# EAGLE schematic Protoboard MX3-11-8-ESP12 (EAGLE 7.7.0)

## Sheet 1 of 2
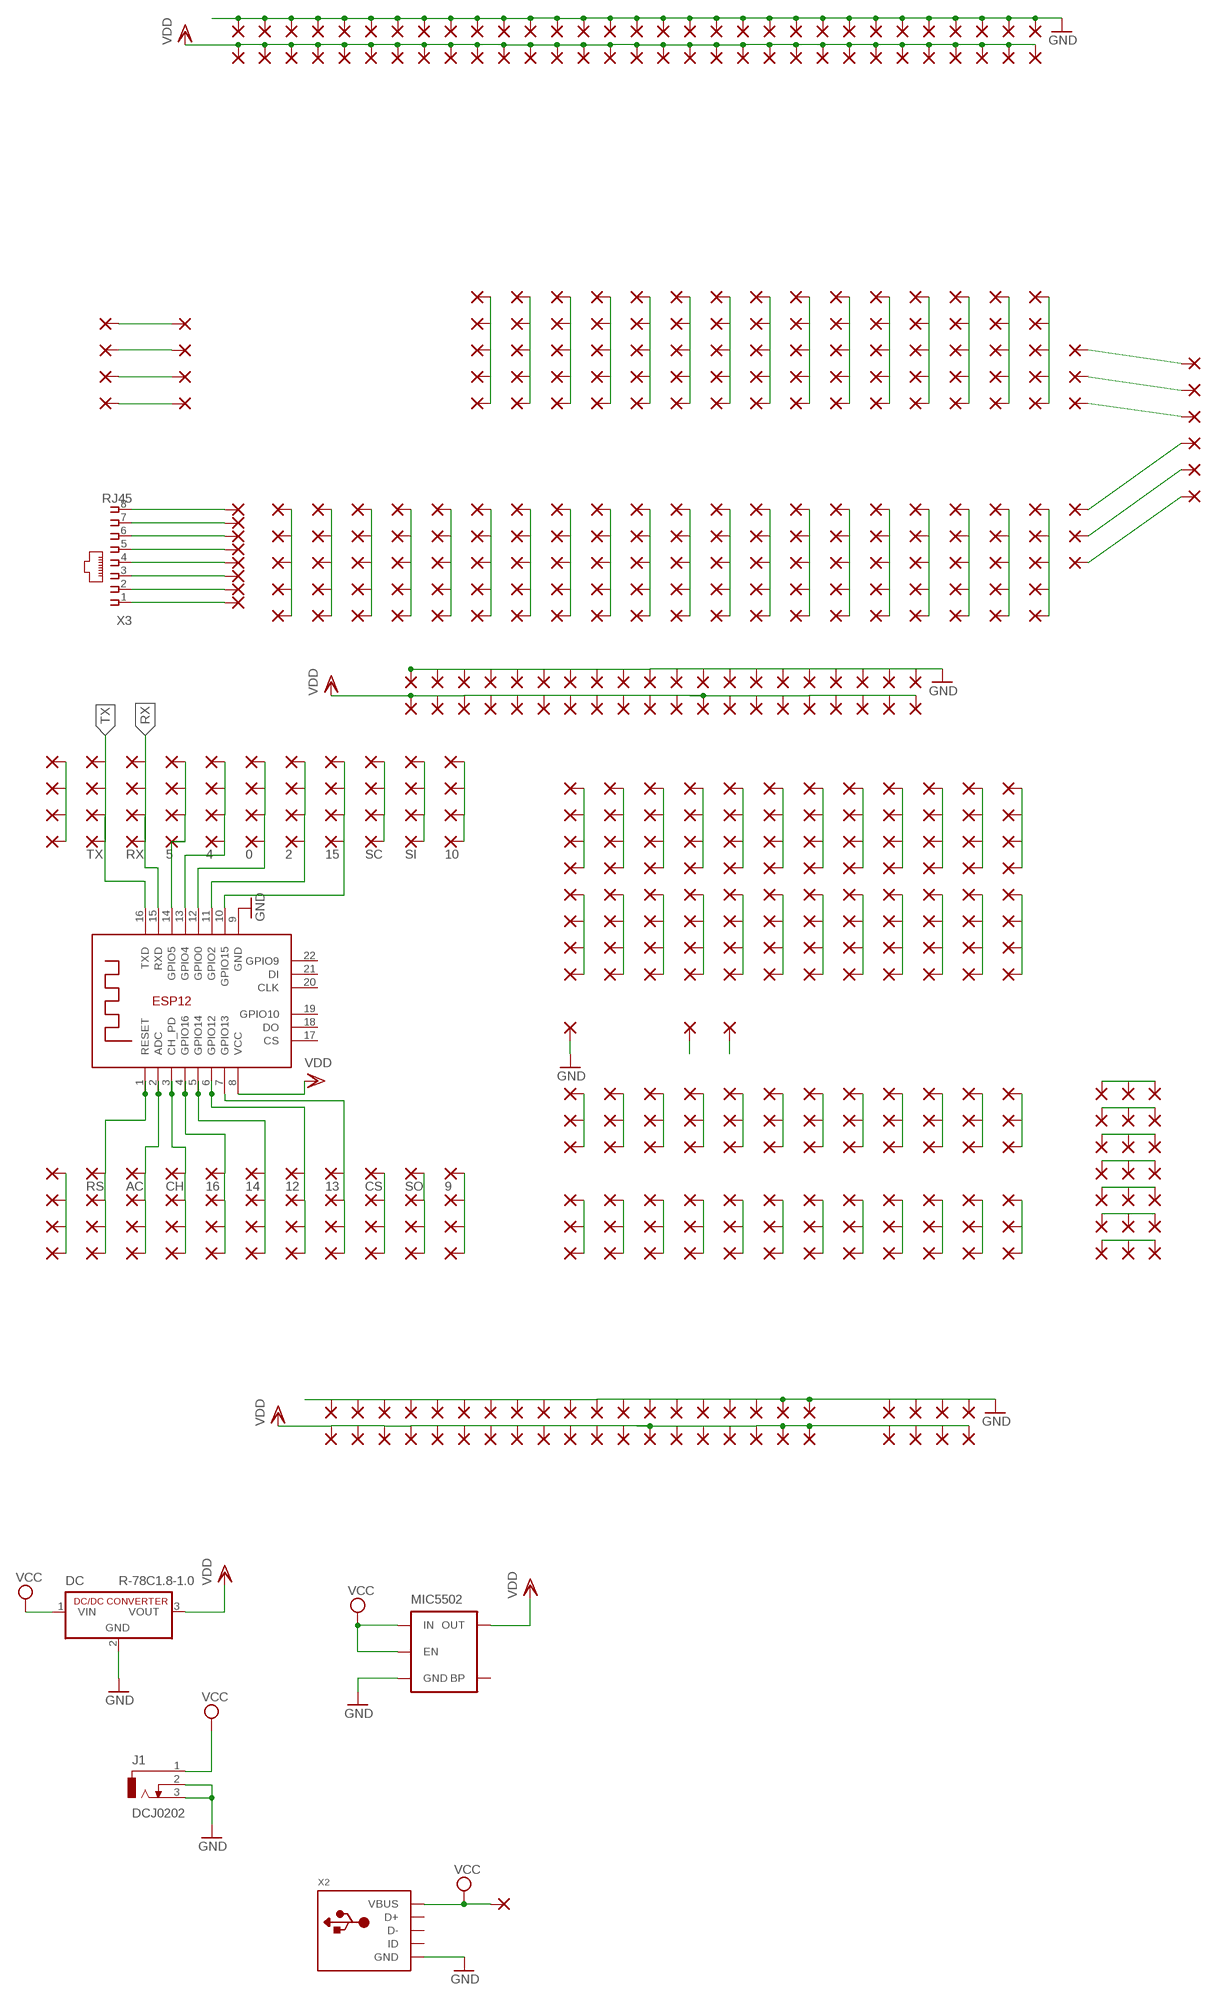
[diagram p0: schematic, sheet 1]

### Parts
1  1,6/0,8  [1,6/0,8]
2  1,6/0,8  [1,6/0,8]
4  1,6/0,8  [1,6/0,8]
5  1,6/0,8  [1,6/0,8]
5V  1,6/0,8  [1,6/0,8]
6  1,6/0,8  [1,6/0,8]
7  1,6/0,8  [1,6/0,8]
8  1,6/0,8  [1,6/0,8]
DC  R-78C1.8-1.0  [SIP3]
J1  DCJ0202  [DCJ0202]
MIC5502  MIC52053.3V  [SOT23-5]
PAD1  1,6/0,8  [1,6/0,8]
PAD2  1,6/0,8  [1,6/0,8]
PAD3  1,6/0,8  [1,6/0,8]
PAD4  1,6/0,8  [1,6/0,8]
PAD5  1,6/0,8  [1,6/0,8]
PAD6  1,6/0,8  [1,6/0,8]
PAD7  1,6/0,8  [1,6/0,8]
PAD8  1,6/0,8  [1,6/0,8]
PAD9  1,6/0,8  [1,6/0,8]
PAD10  1,6/0,8  [1,6/0,8]
PAD11  1,6/0,8  [1,6/0,8]
PAD12  1,6/0,8  [1,6/0,8]
PAD13  1,6/0,8  [1,6/0,8]
PAD14  1,6/0,8  [1,6/0,8]
PAD15  1,6/0,8  [1,6/0,8]
PAD16  1,6/0,8  [1,6/0,8]
PAD17  1,6/0,8  [1,6/0,8]
PAD18  1,6/0,8  [1,6/0,8]
PAD19  1,6/0,8  [1,6/0,8]
PAD20  1,6/0,8  [1,6/0,8]
PAD21  1,6/0,8  [1,6/0,8]
PAD22  1,6/0,8  [1,6/0,8]
PAD23  1,6/0,8  [1,6/0,8]
PAD24  1,6/0,8  [1,6/0,8]
PAD25  1,6/0,8  [1,6/0,8]
PAD26  1,6/0,8  [1,6/0,8]
PAD27  1,6/0,8  [1,6/0,8]
PAD28  1,6/0,8  [1,6/0,8]
PAD29  1,6/0,8  [1,6/0,8]
PAD30  1,6/0,8  [1,6/0,8]
PAD31  1,6/0,8  [1,6/0,8]
PAD32  1,6/0,8  [1,6/0,8]
PAD33  1,6/0,8  [1,6/0,8]
PAD34  1,6/0,8  [1,6/0,8]
PAD35  1,6/0,8  [1,6/0,8]
PAD36  1,6/0,8  [1,6/0,8]
PAD37  1,6/0,8  [1,6/0,8]
PAD38  1,6/0,8  [1,6/0,8]
PAD39  1,6/0,8  [1,6/0,8]
PAD40  1,6/0,8  [1,6/0,8]
PAD41  1,6/0,8  [1,6/0,8]
PAD42  1,6/0,8  [1,6/0,8]
PAD45  1,6/0,8  [1,6/0,8]
PAD46  1,6/0,8  [1,6/0,8]
PAD47  1,6/0,8  [1,6/0,8]
PAD48  1,6/0,8  [1,6/0,8]
PAD52  1,6/0,8  [1,6/0,8]
PAD53  1,6/0,8  [1,6/0,8]
PAD54  1,6/0,8  [1,6/0,8]
PAD55  1,6/0,8  [1,6/0,8]
PAD59  1,6/0,8  [1,6/0,8]
PAD60  1,6/0,8  [1,6/0,8]
PAD61  1,6/0,8  [1,6/0,8]
PAD62  1,6/0,8  [1,6/0,8]
PAD63  1,6/0,8  [1,6/0,8]
PAD64  1,6/0,8  [1,6/0,8]
PAD65  1,6/0,8  [1,6/0,8]
PAD66  1,6/0,8  [1,6/0,8]
PAD67  1,6/0,8  [1,6/0,8]
PAD68  1,6/0,8  [1,6/0,8]
PAD69  1,6/0,8  [1,6/0,8]
PAD70  1,6/0,8  [1,6/0,8]
PAD71  1,6/0,8  [1,6/0,8]
PAD72  1,6/0,8  [1,6/0,8]
PAD73  1,6/0,8  [1,6/0,8]
PAD74  1,6/0,8  [1,6/0,8]
PAD75  1,6/0,8  [1,6/0,8]
PAD76  1,6/0,8  [1,6/0,8]
PAD77  1,6/0,8  [1,6/0,8]
PAD78  1,6/0,8  [1,6/0,8]
PAD79  1,6/0,8  [1,6/0,8]
PAD80  1,6/0,8  [1,6/0,8]
PAD81  1,6/0,8  [1,6/0,8]
PAD82  1,6/0,8  [1,6/0,8]
PAD83  1,6/0,8  [1,6/0,8]
PAD84  1,6/0,8  [1,6/0,8]
PAD85  1,6/0,8  [1,6/0,8]
PAD86  1,6/0,8  [1,6/0,8]
PAD88  1,6/0,8  [1,6/0,8]
PAD89  1,6/0,8  [1,6/0,8]
PAD90  1,6/0,8  [1,6/0,8]
PAD91  1,6/0,8  [1,6/0,8]
PAD92  1,6/0,8  [1,6/0,8]
PAD93  1,6/0,8  [1,6/0,8]
PAD94  1,6/0,8  [1,6/0,8]
PAD97  1,6/0,8  [1,6/0,8]
PAD98  1,6/0,8  [1,6/0,8]
PAD99  1,6/0,8  [1,6/0,8]
PAD100  1,6/0,8  [1,6/0,8]
PAD101  1,6/0,8  [1,6/0,8]
PAD102  1,6/0,8  [1,6/0,8]
PAD103  1,6/0,8  [1,6/0,8]
PAD106  1,6/0,8  [1,6/0,8]
PAD107  1,6/0,8  [1,6/0,8]
PAD108  1,6/0,8  [1,6/0,8]
PAD109  1,6/0,8  [1,6/0,8]
PAD110  1,6/0,8  [1,6/0,8]
PAD111  1,6/0,8  [1,6/0,8]
PAD112  1,6/0,8  [1,6/0,8]
PAD115  1,6/0,8  [1,6/0,8]
PAD116  1,6/0,8  [1,6/0,8]
PAD117  1,6/0,8  [1,6/0,8]
PAD118  1,6/0,8  [1,6/0,8]
PAD119  1,6/0,8  [1,6/0,8]
PAD120  1,6/0,8  [1,6/0,8]
PAD121  1,6/0,8  [1,6/0,8]
PAD122  1,6/0,8  [1,6/0,8]
PAD123  1,6/0,8  [1,6/0,8]
PAD124  1,6/0,8  [1,6/0,8]
PAD125  1,6/0,8  [1,6/0,8]
PAD126  1,6/0,8  [1,6/0,8]
PAD128  1,6/0,8  [1,6/0,8]
PAD129  1,6/0,8  [1,6/0,8]
PAD130  1,6/0,8  [1,6/0,8]
PAD131  1,6/0,8  [1,6/0,8]
PAD132  1,6/0,8  [1,6/0,8]
PAD133  1,6/0,8  [1,6/0,8]
PAD134  1,6/0,8  [1,6/0,8]
PAD135  1,6/0,8  [1,6/0,8]
PAD137  1,6/0,8  [1,6/0,8]
PAD138  1,6/0,8  [1,6/0,8]
PAD139  1,6/0,8  [1,6/0,8]
PAD140  1,6/0,8  [1,6/0,8]
PAD141  1,6/0,8  [1,6/0,8]
PAD142  1,6/0,8  [1,6/0,8]
PAD143  1,6/0,8  [1,6/0,8]
PAD144  1,6/0,8  [1,6/0,8]
PAD146  1,6/0,8  [1,6/0,8]
PAD147  1,6/0,8  [1,6/0,8]
PAD148  1,6/0,8  [1,6/0,8]
PAD149  1,6/0,8  [1,6/0,8]
PAD150  1,6/0,8  [1,6/0,8]
PAD151  1,6/0,8  [1,6/0,8]
PAD152  1,6/0,8  [1,6/0,8]
PAD153  1,6/0,8  [1,6/0,8]
PAD155  1,6/0,8  [1,6/0,8]
PAD156  1,6/0,8  [1,6/0,8]
PAD157  1,6/0,8  [1,6/0,8]
PAD158  1,6/0,8  [1,6/0,8]
PAD159  1,6/0,8  [1,6/0,8]
PAD160  1,6/0,8  [1,6/0,8]
PAD161  1,6/0,8  [1,6/0,8]
PAD162  1,6/0,8  [1,6/0,8]
PAD164  1,6/0,8  [1,6/0,8]
PAD165  1,6/0,8  [1,6/0,8]
PAD166  1,6/0,8  [1,6/0,8]
PAD167  1,6/0,8  [1,6/0,8]
PAD168  1,6/0,8  [1,6/0,8]
PAD169  1,6/0,8  [1,6/0,8]
PAD170  1,6/0,8  [1,6/0,8]
PAD171  1,6/0,8  [1,6/0,8]
PAD173  1,6/0,8  [1,6/0,8]
PAD174  1,6/0,8  [1,6/0,8]
PAD175  1,6/0,8  [1,6/0,8]
PAD176  1,6/0,8  [1,6/0,8]
PAD177  1,6/0,8  [1,6/0,8]
PAD178  1,6/0,8  [1,6/0,8]
PAD179  1,6/0,8  [1,6/0,8]
PAD180  1,6/0,8  [1,6/0,8]
PAD182  1,6/0,8  [1,6/0,8]
PAD183  1,6/0,8  [1,6/0,8]
PAD184  1,6/0,8  [1,6/0,8]
PAD185  1,6/0,8  [1,6/0,8]
PAD186  1,6/0,8  [1,6/0,8]
PAD194  1,6/0,8  [1,6/0,8]
PAD195  1,6/0,8  [1,6/0,8]
PAD196  1,6/0,8  [1,6/0,8]
PAD197  1,6/0,8  [1,6/0,8]
PAD198  1,6/0,8  [1,6/0,8]
PAD199  1,6/0,8  [1,6/0,8]
PAD200  1,6/0,8  [1,6/0,8]
PAD201  1,6/0,8  [1,6/0,8]
PAD202  1,6/0,8  [1,6/0,8]
PAD203  1,6/0,8  [1,6/0,8]
PAD204  1,6/0,8  [1,6/0,8]
PAD205  1,6/0,8  [1,6/0,8]
PAD206  1,6/0,8  [1,6/0,8]
PAD207  1,6/0,8  [1,6/0,8]
PAD208  1,6/0,8  [1,6/0,8]
PAD209  1,6/0,8  [1,6/0,8]
PAD210  1,6/0,8  [1,6/0,8]
PAD211  1,6/0,8  [1,6/0,8]
PAD212  1,6/0,8  [1,6/0,8]
PAD213  1,6/0,8  [1,6/0,8]
PAD214  1,6/0,8  [1,6/0,8]
PAD215  1,6/0,8  [1,6/0,8]
PAD216  1,6/0,8  [1,6/0,8]
PAD217  1,6/0,8  [1,6/0,8]
PAD218  1,6/0,8  [1,6/0,8]
PAD219  1,6/0,8  [1,6/0,8]
PAD220  1,6/0,8  [1,6/0,8]
PAD221  1,6/0,8  [1,6/0,8]
PAD222  1,6/0,8  [1,6/0,8]
PAD223  1,6/0,8  [1,6/0,8]
PAD224  1,6/0,8  [1,6/0,8]
PAD225  1,6/0,8  [1,6/0,8]
PAD226  1,6/0,8  [1,6/0,8]
PAD227  1,6/0,8  [1,6/0,8]
PAD228  1,6/0,8  [1,6/0,8]
PAD229  1,6/0,8  [1,6/0,8]
PAD230  1,6/0,8  [1,6/0,8]
PAD231  1,6/0,8  [1,6/0,8]
PAD232  1,6/0,8  [1,6/0,8]
PAD233  1,6/0,8  [1,6/0,8]
PAD234  1,6/0,8  [1,6/0,8]
PAD235  1,6/0,8  [1,6/0,8]
PAD236  1,6/0,8  [1,6/0,8]
PAD237  1,6/0,8  [1,6/0,8]
PAD238  1,6/0,8  [1,6/0,8]
PAD239  1,6/0,8  [1,6/0,8]
PAD240  1,6/0,8  [1,6/0,8]
PAD241  3,17/1,3  [3,17/1,3]
PAD242  3,17/1,3  [3,17/1,3]
PAD243  3,17/1,3  [3,17/1,3]
PAD244  3,17/1,3  [3,17/1,3]
PAD249  1,6/0,8  [1,6/0,8]
PAD250  1,6/0,8  [1,6/0,8]
PAD251  1,6/0,8  [1,6/0,8]
PAD252  1,6/0,8  [1,6/0,8]
PAD253  1,6/0,8  [1,6/0,8]
PAD254  1,6/0,8  [1,6/0,8]
PAD255  1,6/0,8  [1,6/0,8]
PAD256  1,6/0,8  [1,6/0,8]
PAD257  1,6/0,8  [1,6/0,8]
PAD258  1,6/0,8  [1,6/0,8]
PAD259  TX  1,6/0,8  [1,6/0,8]
PAD267  1,6/0,8  [1,6/0,8]
PAD268  1,6/0,8  [1,6/0,8]
PAD276  1,6/0,8  [1,6/0,8]
PAD277  1,6/0,8  [1,6/0,8]
PAD285  1,6/0,8  [1,6/0,8]
PAD286  1,6/0,8  [1,6/0,8]
PAD294  1,6/0,8  [1,6/0,8]
PAD295  1,6/0,8  [1,6/0,8]
PAD303  1,6/0,8  [1,6/0,8]
PAD304  1,6/0,8  [1,6/0,8]
PAD312  1,6/0,8  [1,6/0,8]
PAD313  1,6/0,8  [1,6/0,8]
PAD321  1,6/0,8  [1,6/0,8]
PAD322  1,6/0,8  [1,6/0,8]
PAD323  1,6/0,8  [1,6/0,8]
PAD324  1,6/0,8  [1,6/0,8]
PAD325  1,6/0,8  [1,6/0,8]
PAD326  1,6/0,8  [1,6/0,8]
PAD327  1,6/0,8  [1,6/0,8]
PAD328  1,6/0,8  [1,6/0,8]
PAD329  1,6/0,8  [1,6/0,8]
PAD330  1,6/0,8  [1,6/0,8]
PAD331  1,6/0,8  [1,6/0,8]
PAD339  1,6/0,8  [1,6/0,8]
PAD340  1,6/0,8  [1,6/0,8]
PAD348  1,6/0,8  [1,6/0,8]
PAD349  1,6/0,8  [1,6/0,8]
PAD357  1,6/0,8  [1,6/0,8]
PAD358  1,6/0,8  [1,6/0,8]
PAD366  1,6/0,8  [1,6/0,8]
PAD367  1,6/0,8  [1,6/0,8]
PAD375  1,6/0,8  [1,6/0,8]
PAD376  1,6/0,8  [1,6/0,8]
PAD384  1,6/0,8  [1,6/0,8]
PAD390  1,6/0,8  [1,6/0,8]
PAD395  1,6/0,8  [1,6/0,8]
PAD396  1,6/0,8  [1,6/0,8]
PAD397  RX  1,6/0,8  [1,6/0,8]
PAD398  1,6/0,8  [1,6/0,8]
PAD399  1,6/0,8  [1,6/0,8]
PAD400  1,6/0,8  [1,6/0,8]
PAD401  5  1,6/0,8  [1,6/0,8]
PAD402  1,6/0,8  [1,6/0,8]
PAD403  1,6/0,8  [1,6/0,8]
PAD404  1,6/0,8  [1,6/0,8]
PAD405  4  1,6/0,8  [1,6/0,8]
PAD406  1,6/0,8  [1,6/0,8]
PAD407  1,6/0,8  [1,6/0,8]
PAD408  1,6/0,8  [1,6/0,8]
PAD409  0  1,6/0,8  [1,6/0,8]
PAD410  1,6/0,8  [1,6/0,8]
PAD411  1,6/0,8  [1,6/0,8]
PAD412  1,6/0,8  [1,6/0,8]
PAD413  2  1,6/0,8  [1,6/0,8]
PAD414  1,6/0,8  [1,6/0,8]
PAD415  1,6/0,8  [1,6/0,8]
PAD416  1,6/0,8  [1,6/0,8]
PAD417  1,6/0,8  [1,6/0,8]
PAD418  1,6/0,8  [1,6/0,8]
PAD419  1,6/0,8  [1,6/0,8]
PAD420  1,6/0,8  [1,6/0,8]
PAD421  1,6/0,8  [1,6/0,8]
PAD422  1,6/0,8  [1,6/0,8]
PAD423  1,6/0,8  [1,6/0,8]
PAD424  1,6/0,8  [1,6/0,8]
PAD425  1,6/0,8  [1,6/0,8]
PAD426  1,6/0,8  [1,6/0,8]
PAD427  1,6/0,8  [1,6/0,8]
PAD428  1,6/0,8  [1,6/0,8]
PAD429  1,6/0,8  [1,6/0,8]
PAD430  1,6/0,8  [1,6/0,8]
PAD431  1,6/0,8  [1,6/0,8]
PAD432  1,6/0,8  [1,6/0,8]
PAD433  1,6/0,8  [1,6/0,8]
PAD434  1,6/0,8  [1,6/0,8]
PAD435  1,6/0,8  [1,6/0,8]
PAD436  1,6/0,8  [1,6/0,8]
PAD437  1,6/0,8  [1,6/0,8]
PAD438  1,6/0,8  [1,6/0,8]
PAD439  1,6/0,8  [1,6/0,8]
PAD440  1,6/0,8  [1,6/0,8]
PAD441  1,6/0,8  [1,6/0,8]
PAD442  1,6/0,8  [1,6/0,8]
PAD443  1,6/0,8  [1,6/0,8]
PAD444  1,6/0,8  [1,6/0,8]
PAD445  1,6/0,8  [1,6/0,8]
PAD446  1,6/0,8  [1,6/0,8]
PAD447  1,6/0,8  [1,6/0,8]
PAD448  1,6/0,8  [1,6/0,8]
PAD449  1,6/0,8  [1,6/0,8]
PAD450  1,6/0,8  [1,6/0,8]
PAD451  1,6/0,8  [1,6/0,8]
PAD452  1,6/0,8  [1,6/0,8]
PAD453  1,6/0,8  [1,6/0,8]
PAD454  1,6/0,8  [1,6/0,8]
PAD455  1,6/0,8  [1,6/0,8]
PAD456  1,6/0,8  [1,6/0,8]
PAD457  1,6/0,8  [1,6/0,8]
PAD458  1,6/0,8  [1,6/0,8]
PAD459  1,6/0,8  [1,6/0,8]
PAD460  1,6/0,8  [1,6/0,8]
PAD461  1,6/0,8  [1,6/0,8]
PAD462  1,6/0,8  [1,6/0,8]
PAD463  1,6/0,8  [1,6/0,8]
PAD471  1,6/0,8  [1,6/0,8]
PAD472  1,6/0,8  [1,6/0,8]
PAD473  1,6/0,8  [1,6/0,8]
PAD474  1,6/0,8  [1,6/0,8]
PAD475  1,6/0,8  [1,6/0,8]
PAD476  1,6/0,8  [1,6/0,8]
PAD477  1,6/0,8  [1,6/0,8]
PAD478  1,6/0,8  [1,6/0,8]
PAD479  1,6/0,8  [1,6/0,8]
PAD480  1,6/0,8  [1,6/0,8]
PAD481  1,6/0,8  [1,6/0,8]
PAD482  1,6/0,8  [1,6/0,8]
PAD483  1,6/0,8  [1,6/0,8]
PAD484  1,6/0,8  [1,6/0,8]
PAD485  1,6/0,8  [1,6/0,8]
PAD486  1,6/0,8  [1,6/0,8]
PAD487  1,6/0,8  [1,6/0,8]
PAD488  1,6/0,8  [1,6/0,8]
PAD489  1,6/0,8  [1,6/0,8]
PAD490  1,6/0,8  [1,6/0,8]
PAD491  1,6/0,8  [1,6/0,8]
PAD492  1,6/0,8  [1,6/0,8]
PAD493  1,6/0,8  [1,6/0,8]
PAD494  1,6/0,8  [1,6/0,8]
PAD495  1,6/0,8  [1,6/0,8]
PAD496  1,6/0,8  [1,6/0,8]
PAD497  1,6/0,8  [1,6/0,8]
PAD498  1,6/0,8  [1,6/0,8]
PAD499  1,6/0,8  [1,6/0,8]
PAD500  1,6/0,8  [1,6/0,8]
PAD501  1,6/0,8  [1,6/0,8]
PAD502  1,6/0,8  [1,6/0,8]
PAD503  1,6/0,8  [1,6/0,8]
PAD504  1,6/0,8  [1,6/0,8]
PAD505  1,6/0,8  [1,6/0,8]
PAD506  1,6/0,8  [1,6/0,8]
PAD507  1,6/0,8  [1,6/0,8]
PAD508  1,6/0,8  [1,6/0,8]
PAD509  1,6/0,8  [1,6/0,8]
PAD510  1,6/0,8  [1,6/0,8]
PAD511  1,6/0,8  [1,6/0,8]
PAD512  1,6/0,8  [1,6/0,8]
PAD513  1,6/0,8  [1,6/0,8]
PAD514  1,6/0,8  [1,6/0,8]
PAD515  1,6/0,8  [1,6/0,8]
PAD516  1,6/0,8  [1,6/0,8]
PAD517  1,6/0,8  [1,6/0,8]
PAD518  1,6/0,8  [1,6/0,8]
PAD519  1,6/0,8  [1,6/0,8]
PAD520  1,6/0,8  [1,6/0,8]
PAD521  1,6/0,8  [1,6/0,8]
PAD522  1,6/0,8  [1,6/0,8]
PAD523  1,6/0,8  [1,6/0,8]
PAD524  1,6/0,8  [1,6/0,8]
PAD525  1,6/0,8  [1,6/0,8]
PAD526  1,6/0,8  [1,6/0,8]
PAD527  1,6/0,8  [1,6/0,8]
PAD528  1,6/0,8  [1,6/0,8]
PAD529  1,6/0,8  [1,6/0,8]
PAD530  1,6/0,8  [1,6/0,8]
PAD531  1,6/0,8  [1,6/0,8]
PAD532  1,6/0,8  [1,6/0,8]
PAD533  1,6/0,8  [1,6/0,8]
PAD534  1,6/0,8  [1,6/0,8]
PAD535  1,6/0,8  [1,6/0,8]
PAD536  1,6/0,8  [1,6/0,8]
PAD537  1,6/0,8  [1,6/0,8]
PAD538  1,6/0,8  [1,6/0,8]
PAD539  1,6/0,8  [1,6/0,8]
PAD540  1,6/0,8  [1,6/0,8]
PAD541  1,6/0,8  [1,6/0,8]
PAD542  1,6/0,8  [1,6/0,8]
PAD543  1,6/0,8  [1,6/0,8]
PAD544  1,6/0,8  [1,6/0,8]
PAD547  1,6/0,8  [1,6/0,8]
PAD548  1,6/0,8  [1,6/0,8]
PAD549  1,6/0,8  [1,6/0,8]
PAD550  1,6/0,8  [1,6/0,8]
PAD551  1,6/0,8  [1,6/0,8]
PAD554  1,6/0,8  [1,6/0,8]
PAD555  1,6/0,8  [1,6/0,8]
PAD556  1,6/0,8  [1,6/0,8]
PAD557  1,6/0,8  [1,6/0,8]
PAD558  1,6/0,8  [1,6/0,8]
PAD560  1,6/0,8  [1,6/0,8]
PAD561  1,6/0,8  [1,6/0,8]
PAD562  1,6/0,8  [1,6/0,8]
PAD563  1,6/0,8  [1,6/0,8]
PAD564  1,6/0,8  [1,6/0,8]
PAD565  1,6/0,8  [1,6/0,8]
PAD566  1,6/0,8  [1,6/0,8]
PAD567  1,6/0,8  [1,6/0,8]
PAD568  1,6/0,8  [1,6/0,8]
PAD569  1,6/0,8  [1,6/0,8]
PAD570  1,6/0,8  [1,6/0,8]
PAD571  1,6/0,8  [1,6/0,8]
PAD572  1,6/0,8  [1,6/0,8]
PAD573  1,6/0,8  [1,6/0,8]
PAD574  1,6/0,8  [1,6/0,8]
PAD575  1,6/0,8  [1,6/0,8]
PAD576  1,6/0,8  [1,6/0,8]
PAD577  1,6/0,8  [1,6/0,8]
PAD578  1,6/0,8  [1,6/0,8]
PAD579  1,6/0,8  [1,6/0,8]
PAD580  1,6/0,8  [1,6/0,8]
PAD581  1,6/0,8  [1,6/0,8]
PAD582  1,6/0,8  [1,6/0,8]
PAD583  1,6/0,8  [1,6/0,8]
PAD584  1,6/0,8  [1,6/0,8]
PAD585  1,6/0,8  [1,6/0,8]
PAD586  1,6/0,8  [1,6/0,8]
PAD587  1,6/0,8  [1,6/0,8]
PAD588  1,6/0,8  [1,6/0,8]
PAD589  1,6/0,8  [1,6/0,8]
PAD590  1,6/0,8  [1,6/0,8]
PAD591  1,6/0,8  [1,6/0,8]
PAD592  1,6/0,8  [1,6/0,8]
PAD593  1,6/0,8  [1,6/0,8]
PAD594  1,6/0,8  [1,6/0,8]
PAD595  1,6/0,8  [1,6/0,8]
PAD596  1,6/0,8  [1,6/0,8]
PAD597  1,6/0,8  [1,6/0,8]
PAD598  1,6/0,8  [1,6/0,8]
PAD599  1,6/0,8  [1,6/0,8]
PAD600  1,6/0,8  [1,6/0,8]
PAD601  1,6/0,8  [1,6/0,8]
PAD602  1,6/0,8  [1,6/0,8]
PAD603  1,6/0,8  [1,6/0,8]
PAD604  1,6/0,8  [1,6/0,8]
PAD605  1,6/0,8  [1,6/0,8]
PAD606  1,6/0,8  [1,6/0,8]
PAD607  1,6/0,8  [1,6/0,8]
PAD608  1,6/0,8  [1,6/0,8]
PAD609  1,6/0,8  [1,6/0,8]
PAD610  1,6/0,8  [1,6/0,8]
PAD611  1,6/0,8  [1,6/0,8]
PAD612  1,6/0,8  [1,6/0,8]
PAD613  1,6/0,8  [1,6/0,8]
PAD614  1,6/0,8  [1,6/0,8]
PAD615  1,6/0,8  [1,6/0,8]
PAD617  1,6/0,8  [1,6/0,8]
PAD618  1,6/0,8  [1,6/0,8]
PAD619  1,6/0,8  [1,6/0,8]
PAD620  1,6/0,8  [1,6/0,8]
PAD621  1,6/0,8  [1,6/0,8]
PAD622  15  1,6/0,8  [1,6/0,8]
PAD623  1,6/0,8  [1,6/0,8]
PAD624  1,6/0,8  [1,6/0,8]
PAD625  1,6/0,8  [1,6/0,8]
PAD626  SC  1,6/0,8  [1,6/0,8]
PAD627  AC  1,6/0,8  [1,6/0,8]
PAD628  1,6/0,8  [1,6/0,8]
PAD629  1,6/0,8  [1,6/0,8]
PAD630  1,6/0,8  [1,6/0,8]
PAD631  CH  1,6/0,8  [1,6/0,8]
PAD632  1,6/0,8  [1,6/0,8]
PAD633  1,6/0,8  [1,6/0,8]
PAD634  1,6/0,8  [1,6/0,8]
PAD635  16  1,6/0,8  [1,6/0,8]
PAD636  1,6/0,8  [1,6/0,8]
PAD637  1,6/0,8  [1,6/0,8]
PAD638  1,6/0,8  [1,6/0,8]
PAD639  14  1,6/0,8  [1,6/0,8]
PAD640  1,6/0,8  [1,6/0,8]
PAD641  1,6/0,8  [1,6/0,8]
PAD642  1,6/0,8  [1,6/0,8]
PAD643  1,6/0,8  [1,6/0,8]
PAD644  1,6/0,8  [1,6/0,8]
PAD645  1,6/0,8  [1,6/0,8]
PAD646  1,6/0,8  [1,6/0,8]
PAD647  1,6/0,8  [1,6/0,8]
PAD648  1,6/0,8  [1,6/0,8]
PAD649  1,6/0,8  [1,6/0,8]
PAD650  1,6/0,8  [1,6/0,8]
PAD651  1,6/0,8  [1,6/0,8]
PAD652  1,6/0,8  [1,6/0,8]
PAD653  1,6/0,8  [1,6/0,8]
PAD654  1,6/0,8  [1,6/0,8]
PAD655  1,6/0,8  [1,6/0,8]
PAD656  1,6/0,8  [1,6/0,8]
PAD657  1,6/0,8  [1,6/0,8]
PAD658  1,6/0,8  [1,6/0,8]
PAD659  1,6/0,8  [1,6/0,8]
PAD660  1,6/0,8  [1,6/0,8]
PAD661  1,6/0,8  [1,6/0,8]
PAD662  1,6/0,8  [1,6/0,8]
PAD663  1,6/0,8  [1,6/0,8]
PAD664  1,6/0,8  [1,6/0,8]
PAD665  1,6/0,8  [1,6/0,8]
PAD666  1,6/0,8  [1,6/0,8]
PAD667  1,6/0,8  [1,6/0,8]
PAD668  1,6/0,8  [1,6/0,8]
PAD669  1,6/0,8  [1,6/0,8]
PAD670  1,6/0,8  [1,6/0,8]
PAD671  1,6/0,8  [1,6/0,8]
PAD672  1,6/0,8  [1,6/0,8]
PAD673  1,6/0,8  [1,6/0,8]
PAD674  1,6/0,8  [1,6/0,8]
PAD675  1,6/0,8  [1,6/0,8]
PAD676  1,6/0,8  [1,6/0,8]
PAD679  1,6/0,8  [1,6/0,8]
PAD680  1,6/0,8  [1,6/0,8]
PAD681  1,6/0,8  [1,6/0,8]
PAD682  1,6/0,8  [1,6/0,8]
PAD683  1,6/0,8  [1,6/0,8]
PAD686  1,6/0,8  [1,6/0,8]
PAD687  1,6/0,8  [1,6/0,8]
PAD688  1,6/0,8  [1,6/0,8]
PAD689  1,6/0,8  [1,6/0,8]
PAD690  1,6/0,8  [1,6/0,8]
PAD693  1,6/0,8  [1,6/0,8]
PAD694  1,6/0,8  [1,6/0,8]
PAD695  1,6/0,8  [1,6/0,8]
PAD696  1,6/0,8  [1,6/0,8]
PAD697  1,6/0,8  [1,6/0,8]
PAD700  1,6/0,8  [1,6/0,8]
PAD701  1,6/0,8  [1,6/0,8]
PAD702  1,6/0,8  [1,6/0,8]
PAD703  1,6/0,8  [1,6/0,8]
PAD704  1,6/0,8  [1,6/0,8]
PAD707  1,6/0,8  [1,6/0,8]
PAD708  1,6/0,8  [1,6/0,8]
PAD709  1,6/0,8  [1,6/0,8]
PAD710  1,6/0,8  [1,6/0,8]
PAD711  1,6/0,8  [1,6/0,8]
PAD714  1,6/0,8  [1,6/0,8]
PAD715  1,6/0,8  [1,6/0,8]
PAD716  1,6/0,8  [1,6/0,8]
PAD717  1,6/0,8  [1,6/0,8]
PAD718  1,6/0,8  [1,6/0,8]
PAD721  1,6/0,8  [1,6/0,8]
PAD722  1,6/0,8  [1,6/0,8]
PAD723  1,6/0,8  [1,6/0,8]
PAD724  1,6/0,8  [1,6/0,8]
PAD725  1,6/0,8  [1,6/0,8]
PAD728  1,6/0,8  [1,6/0,8]
PAD729  1,6/0,8  [1,6/0,8]
PAD730  1,6/0,8  [1,6/0,8]
PAD731  1,6/0,8  [1,6/0,8]
PAD732  1,6/0,8  [1,6/0,8]
PAD734  1,6/0,8  [1,6/0,8]
PAD742  12  1,6/0,8  [1,6/0,8]
PAD743  1,6/0,8  [1,6/0,8]
PAD744  1,6/0,8  [1,6/0,8]
PAD745  1,6/0,8  [1,6/0,8]
PAD746  13  1,6/0,8  [1,6/0,8]
PAD747  1,6/0,8  [1,6/0,8]
PAD748  1,6/0,8  [1,6/0,8]
PAD749  1,6/0,8  [1,6/0,8]
PAD751  3,17/1,3  [3,17/1,3]
PAD752  3,17/1,3  [3,17/1,3]
PAD753  3,17/1,3  [3,17/1,3]
PAD754  3,17/1,3  [3,17/1,3]
PAD755  3,17/1,3  [3,17/1,3]
PAD756  3,17/1,3  [3,17/1,3]
PAD757  1,6/0,8  [1,6/0,8]
PAD758  CS  1,6/0,8  [1,6/0,8]
PAD759  1,6/0,8  [1,6/0,8]
PAD760  1,6/0,8  [1,6/0,8]
PAD761  1,6/0,8  [1,6/0,8]
PAD762  1,6/0,8  [1,6/0,8]
PAD763  1,6/0,8  [1,6/0,8]
PAD764  1,6/0,8  [1,6/0,8]
PAD765  SI  1,6/0,8  [1,6/0,8]
PAD766  1,6/0,8  [1,6/0,8]
PAD767  1,6/0,8  [1,6/0,8]
PAD768  1,6/0,8  [1,6/0,8]
PAD769  10  1,6/0,8  [1,6/0,8]
PAD770  RS  1,6/0,8  [1,6/0,8]
PAD771  1,6/0,8  [1,6/0,8]
PAD772  1,6/0,8  [1,6/0,8]
PAD773  1,6/0,8  [1,6/0,8]
PAD774  SO  1,6/0,8  [1,6/0,8]
PAD775  1,6/0,8  [1,6/0,8]
PAD776  1,6/0,8  [1,6/0,8]
PAD777  1,6/0,8  [1,6/0,8]
PAD778  9  1,6/0,8  [1,6/0,8]
PAD779  1,6/0,8  [1,6/0,8]
PAD780  1,6/0,8  [1,6/0,8]
PAD781  1,6/0,8  [1,6/0,8]
PAD783  1,6/0,8  [1,6/0,8]
PAD784  1,6/0,8  [1,6/0,8]
PAD785  1,6/0,8  [1,6/0,8]
PAD786  1,6/0,8  [1,6/0,8]
PAD787  1,6/0,8  [1,6/0,8]
PAD788  1,6/0,8  [1,6/0,8]
PAD789  1,6/0,8  [1,6/0,8]
PAD790  1,6/0,8  [1,6/0,8]
PAD792  1,6/0,8  [1,6/0,8]
PAD793  1,6/0,8  [1,6/0,8]
PAD794  1,6/0,8  [1,6/0,8]
RJ-3  1,6/0,8  [1,6/0,8]
RX  1,6/0,8  [1,6/0,8]
TX  1,6/0,8  [1,6/0,8]
X1  ESP-12E  [ESP-12E]
X2  USBMICRO_20329  [4UCONN_20329]
X3  RJ45  RJ45-8L-B  [RJ45-NO-SHIELD]

### Nets
GND: DC.2(GND) J1.2 J1.3 MIC5502.2(GND) PAD4.1(P) PAD12.1(P) PAD17.1(P) PAD22.1(P) PAD23.1(P) PAD24.1(P) PAD25.1(P) PAD26.1(P) PAD27.1(P) PAD28.1(P) PAD29.1(P) PAD30.1(P) PAD31.1(P) PAD32.1(P) PAD33.1(P) PAD36.1(P) PAD38.1(P) PAD54.1(P) PAD118.1(P) PAD140.1(P) PAD141.1(P) PAD149.1(P) PAD249.1(P) PAD255.1(P) PAD276.1(P) PAD277.1(P) PAD285.1(P) PAD286.1(P) PAD326.1(P) PAD327.1(P) PAD328.1(P) PAD329.1(P) PAD330.1(P) PAD331.1(P) PAD339.1(P) PAD421.1(P) PAD422.1(P) PAD423.1(P) PAD424.1(P) PAD425.1(P) PAD426.1(P) PAD427.1(P) PAD428.1(P) PAD429.1(P) PAD430.1(P) PAD431.1(P) PAD432.1(P) PAD433.1(P) PAD434.1(P) PAD435.1(P) PAD436.1(P) PAD439.1(P) PAD440.1(P) PAD441.1(P) PAD447.1(P) PAD471.1(P) PAD472.1(P) PAD473.1(P) PAD474.1(P) PAD475.1(P) PAD476.1(P) PAD477.1(P) PAD478.1(P) PAD479.1(P) PAD525.1(P) PAD619.1(P) PAD620.1(P) PAD621.1(P) PAD643.1(P) PAD734.1(P) PAD757.1(P) PAD783.1(P) PAD788.1(P) PAD789.1(P) PAD790.1(P) X1.9(GND) X2.BASE@1(GND) X2.BASE@2(GND) X2.GND X2.SPRT@1(GND) X2.SPRT@2(GND) X2.SPRT@3(GND) X2.SPRT@4(GND)
N$2: PAD97.1(P) PAD98.1(P) PAD99.1(P)
N$3: PAD34.1(P) PAD35.1(P) PAD37.1(P) PAD40.1(P)
N$4: PAD45.1(P) PAD46.1(P) PAD47.1(P)
N$5: PAD106.1(P) PAD107.1(P) PAD108.1(P)
N$6: PAD59.1(P) PAD60.1(P) PAD61.1(P)
N$7: PAD83.1(P) PAD84.1(P) PAD85.1(P)
N$8: PAD92.1(P) PAD93.1(P) PAD94.1(P)
N$9: PAD101.1(P) PAD102.1(P) PAD103.1(P)
N$10: PAD110.1(P) PAD111.1(P) PAD112.1(P)
N$11: PAD115.1(P) PAD116.1(P) PAD117.1(P)
N$12: PAD124.1(P) PAD125.1(P) PAD126.1(P)
N$13: PAD133.1(P) PAD134.1(P) PAD135.1(P)
N$14: PAD142.1(P) PAD143.1(P) PAD144.1(P)
N$15: PAD151.1(P) PAD152.1(P) PAD153.1(P)
N$16: PAD160.1(P) PAD161.1(P) PAD162.1(P)
N$17: PAD169.1(P) PAD170.1(P) PAD171.1(P)
N$18: PAD178.1(P) PAD179.1(P) PAD180.1(P)
N$19: PAD42.1(P) PAD241.1(P)
N$20: PAD199.1(P) PAD200.1(P) PAD201.1(P) PAD202.1(P)
N$21: PAD208.1(P) PAD209.1(P) PAD210.1(P) PAD211.1(P)
N$22: PAD217.1(P) PAD218.1(P) PAD219.1(P) PAD220.1(P)
N$23: PAD66.1(P) PAD67.1(P) PAD68.1(P)
N$24: PAD73.1(P) PAD74.1(P) PAD75.1(P)
N$25: PAD41.1(P) PAD242.1(P)
N$26: PAD122.1(P) PAD123.1(P) PAD131.1(P) PAD132.1(P)
N$27: PAD39.1(P) PAD243.1(P)
N$28: PAD15.1(P) PAD244.1(P)
N$29: PAD762.1(P) PAD763.1(P) PAD764.1(P) PAD765.1(P)
N$30: PAD766.1(P) PAD767.1(P) PAD768.1(P) PAD769.1(P)
N$34: PAD167.1(P) PAD168.1(P) PAD176.1(P) PAD177.1(P)
N$42: PAD79.1(P) PAD80.1(P) PAD81.1(P)
N$43: PAD88.1(P) PAD89.1(P) PAD90.1(P)
N$44: PAD119.1(P) PAD120.1(P) PAD121.1(P)
N$45: PAD195.1(P) PAD203.1(P) PAD204.1(P) PAD212.1(P)
N$46: PAD250.1(P) PAD251.1(P) PAD252.1(P) PAD253.1(P) PAD254.1(P)
N$47: PAD398.1(P) PAD399.1(P) PAD400.1(P) PAD401.1(P) X1.14(GPIO5)
N$48: PAD402.1(P) PAD403.1(P) PAD404.1(P) PAD405.1(P) X1.13(GPIO4)
N$49: PAD223.1(P) PAD224.1(P) PAD225.1(P) PAD226.1(P)
N$50: PAD230.1(P) PAD231.1(P) PAD232.1(P) PAD233.1(P)
N$51: PAD237.1(P) PAD238.1(P) PAD239.1(P) PAD240.1(P)
N$52: PAD406.1(P) PAD407.1(P) PAD408.1(P) PAD409.1(P) X1.12(GPIO0)
N$53: PAD410.1(P) PAD411.1(P) PAD412.1(P) PAD413.1(P) X1.11(GPIO2)
N$54: PAD417.1(P) PAD418.1(P) PAD419.1(P) PAD622.1(P) X1.10(GPIO15)
N$55: PAD623.1(P) PAD624.1(P) PAD625.1(P) PAD626.1(P)
N$56: PAD639.1(P) PAD640.1(P) PAD641.1(P) PAD642.1(P) X1.5(GPIO14)
N$57: PAD758.1(P) PAD759.1(P) PAD760.1(P) PAD761.1(P)
N$59: PAD357.1(P) PAD358.1(P) PAD366.1(P) PAD367.1(P)
N$60: PAD390.1(P) PAD395.1(P) PAD414.1(P) PAD415.1(P)
N$61: PAD438.1(P) PAD457.1(P) PAD458.1(P) PAD463.1(P)
N$63: 2.1(P) X3.1
N$64: RJ-3.1(P) X3.2
N$65: 4.1(P) X3.3
N$66: PAD491.1(P) PAD492.1(P) PAD493.1(P) PAD494.1(P) PAD495.1(P)
N$67: PAD498.1(P) PAD499.1(P) PAD500.1(P) PAD501.1(P) PAD502.1(P)
N$68: PAD505.1(P) PAD506.1(P) PAD507.1(P) PAD508.1(P) PAD509.1(P)
N$69: PAD512.1(P) PAD513.1(P) PAD514.1(P) PAD515.1(P) PAD516.1(P)
N$70: PAD519.1(P) PAD520.1(P) PAD521.1(P) PAD522.1(P) PAD523.1(P)
N$71: PAD526.1(P) PAD527.1(P) PAD528.1(P) PAD529.1(P) PAD530.1(P)
N$72: PAD533.1(P) PAD534.1(P) PAD535.1(P) PAD536.1(P) PAD537.1(P)
N$73: PAD540.1(P) PAD541.1(P) PAD542.1(P) PAD543.1(P) PAD544.1(P)
N$74: PAD547.1(P) PAD548.1(P) PAD549.1(P) PAD550.1(P) PAD551.1(P)
N$75: PAD554.1(P) PAD555.1(P) PAD556.1(P) PAD557.1(P) PAD558.1(P)
N$76: PAD561.1(P) PAD562.1(P) PAD563.1(P) PAD564.1(P) PAD565.1(P)
N$77: PAD568.1(P) PAD569.1(P) PAD570.1(P) PAD571.1(P) PAD572.1(P)
N$78: PAD575.1(P) PAD576.1(P) PAD577.1(P) PAD578.1(P) PAD579.1(P)
N$79: PAD582.1(P) PAD583.1(P) PAD584.1(P) PAD585.1(P) PAD586.1(P)
N$80: PAD589.1(P) PAD590.1(P) PAD591.1(P) PAD592.1(P) PAD593.1(P)
N$81: PAD596.1(P) PAD597.1(P) PAD598.1(P) PAD599.1(P) PAD600.1(P)
N$82: PAD603.1(P) PAD604.1(P) PAD605.1(P) PAD606.1(P) PAD607.1(P)
N$83: PAD610.1(P) PAD611.1(P) PAD612.1(P) PAD613.1(P) PAD614.1(P)
N$84: 5.1(P) X3.4
N$86: PAD778.1(P) PAD779.1(P) PAD780.1(P) PAD781.1(P)
N$87: PAD770.1(P) PAD771.1(P) PAD772.1(P) PAD773.1(P) X1.1(RESET)
N$88: PAD627.1(P) PAD628.1(P) PAD629.1(P) PAD630.1(P) X1.2(ADC)
N$89: 6.1(P) X3.5
N$90: PAD635.1(P) PAD636.1(P) PAD637.1(P) PAD638.1(P) X1.4(GPIO16)
N$91: PAD742.1(P) PAD743.1(P) PAD744.1(P) PAD745.1(P) X1.6(GPIO12)
N$92: PAD644.1(P) PAD645.1(P) PAD646.1(P) PAD647.1(P) PAD648.1(P)
N$93: PAD651.1(P) PAD652.1(P) PAD653.1(P) PAD654.1(P) PAD655.1(P)
N$94: PAD658.1(P) PAD659.1(P) PAD660.1(P) PAD661.1(P) PAD662.1(P)
N$95: PAD665.1(P) PAD666.1(P) PAD667.1(P) PAD668.1(P) PAD669.1(P)
N$96: PAD672.1(P) PAD673.1(P) PAD674.1(P) PAD675.1(P) PAD676.1(P)
N$97: PAD679.1(P) PAD680.1(P) PAD681.1(P) PAD682.1(P) PAD683.1(P)
N$98: PAD686.1(P) PAD687.1(P) PAD688.1(P) PAD689.1(P) PAD690.1(P)
N$99: PAD693.1(P) PAD694.1(P) PAD695.1(P) PAD696.1(P) PAD697.1(P)
N$100: PAD700.1(P) PAD701.1(P) PAD702.1(P) PAD703.1(P) PAD704.1(P)
N$101: PAD707.1(P) PAD708.1(P) PAD709.1(P) PAD710.1(P) PAD711.1(P)
N$102: 7.1(P) X3.6
N$103: 8.1(P) X3.7
N$104: 1.1(P) X3.8
N$105: PAD518.1(P) PAD524.1(P) PAD531.1(P) PAD532.1(P) PAD538.1(P)
N$107: PAD560.1(P) PAD566.1(P) PAD567.1(P) PAD573.1(P)
N$108: PAD656.1(P) PAD756.1(P)
N$109: PAD657.1(P) PAD755.1(P)
N$110: PAD714.1(P) PAD715.1(P) PAD716.1(P) PAD717.1(P) PAD718.1(P)
N$111: PAD721.1(P) PAD722.1(P) PAD723.1(P) PAD724.1(P) PAD725.1(P)
N$112: PAD728.1(P) PAD729.1(P) PAD730.1(P) PAD731.1(P) PAD732.1(P)
N$113: PAD631.1(P) PAD632.1(P) PAD633.1(P) PAD634.1(P) X1.3(CH_PD)
N$114: PAD663.1(P) PAD754.1(P)
N$115: PAD664.1(P) PAD753.1(P)
N$116: PAD670.1(P) PAD752.1(P)
N$117: PAD671.1(P) PAD751.1(P)
N$118: PAD63.1(P) PAD64.1(P) PAD65.1(P)
N$119: PAD77.1(P) PAD78.1(P) PAD86.1(P)
N$120: PAD70.1(P) PAD71.1(P) PAD72.1(P)
N$121: PAD746.1(P) PAD747.1(P) PAD748.1(P) PAD749.1(P) X1.7(GPIO13)
N$122: PAD774.1(P) PAD775.1(P) PAD776.1(P) PAD777.1(P)
N$125: PAD164.1(P) PAD165.1(P) PAD166.1(P)
N$126: PAD182.1(P) PAD183.1(P) PAD184.1(P)
N$127: PAD173.1(P) PAD174.1(P) PAD175.1(P)
N$128: PAD128.1(P) PAD129.1(P) PAD130.1(P)
N$129: PAD137.1(P) PAD138.1(P) PAD139.1(P)
N$130: PAD146.1(P) PAD147.1(P) PAD148.1(P)
N$131: PAD155.1(P) PAD156.1(P) PAD157.1(P)
N$133: PAD214.1(P) PAD215.1(P) PAD216.1(P) PAD581.1(P)
N$134: PAD205.1(P) PAD206.1(P) PAD207.1(P) PAD580.1(P)
N$135: PAD1.1(P) PAD2.1(P) PAD3.1(P) PAD587.1(P)
N$136: PAD150.1(P) PAD158.1(P) PAD159.1(P) PAD588.1(P)
N$137: PAD185.1(P) PAD186.1(P) PAD194.1(P) PAD594.1(P)
N$138: PAD213.1(P) PAD221.1(P) PAD222.1(P) PAD595.1(P)
N$139: PAD227.1(P) PAD228.1(P) PAD229.1(P) PAD601.1(P)
N$140: PAD234.1(P) PAD235.1(P) PAD236.1(P) PAD602.1(P)
N$141: PAD340.1(P) PAD348.1(P) PAD349.1(P) PAD608.1(P)
N$142: PAD375.1(P) PAD376.1(P) PAD384.1(P) PAD609.1(P)
N$143: PAD416.1(P) PAD420.1(P) PAD437.1(P) PAD615.1(P)
N$145: PAD196.1(P) PAD197.1(P) PAD198.1(P) PAD574.1(P)
N$146: PAD48.1(P) PAD52.1(P) PAD53.1(P) PAD55.1(P) PAD62.1(P)
N$147: PAD69.1(P) PAD76.1(P) PAD82.1(P) PAD91.1(P) PAD100.1(P)
RX: PAD267.1(P) PAD268.1(P) PAD396.1(P) PAD397.1(P) RX.1(P) X1.15(RXD)
TX: PAD256.1(P) PAD257.1(P) PAD258.1(P) PAD259.1(P) TX.1(P) X1.16(TXD)
VCC: 5V.1(P) DC.1(VIN) J1.1 MIC5502.1(IN) MIC5502.3(EN) X2.VBUS
VDD: DC.3(VOUT) MIC5502.5(OUT) PAD5.1(P) PAD6.1(P) PAD7.1(P) PAD8.1(P) PAD9.1(P) PAD10.1(P) PAD11.1(P) PAD13.1(P) PAD14.1(P) PAD16.1(P) PAD18.1(P) PAD19.1(P) PAD20.1(P) PAD21.1(P) PAD109.1(P) PAD294.1(P) PAD295.1(P) PAD303.1(P) PAD304.1(P) PAD312.1(P) PAD313.1(P) PAD321.1(P) PAD322.1(P) PAD323.1(P) PAD324.1(P) PAD325.1(P) PAD442.1(P) PAD443.1(P) PAD444.1(P) PAD445.1(P) PAD446.1(P) PAD448.1(P) PAD449.1(P) PAD450.1(P) PAD451.1(P) PAD452.1(P) PAD453.1(P) PAD454.1(P) PAD455.1(P) PAD456.1(P) PAD459.1(P) PAD460.1(P) PAD461.1(P) PAD462.1(P) PAD480.1(P) PAD481.1(P) PAD482.1(P) PAD483.1(P) PAD484.1(P) PAD485.1(P) PAD486.1(P) PAD487.1(P) PAD488.1(P) PAD489.1(P) PAD490.1(P) PAD496.1(P) PAD497.1(P) PAD503.1(P) PAD504.1(P) PAD510.1(P) PAD511.1(P) PAD517.1(P) PAD539.1(P) PAD617.1(P) PAD618.1(P) PAD649.1(P) PAD650.1(P) PAD784.1(P) PAD785.1(P) PAD786.1(P) PAD787.1(P) PAD792.1(P) PAD793.1(P) PAD794.1(P) X1.8(VCC)
Unconnected: MIC5502.4(BP) X1.17(CS) X1.18(DO) X1.19(GPIO10) X1.20(CLK) X1.21(DI) X1.22(GPIO9) X2.D+ X2.D- X2.ID

## Sheet 2 of 2

## Library data of the parts
1 2 4 5 5V 6-8 PAD1-PAD42 PAD45-PAD48 PAD52-PAD55 PAD59-PAD86 PAD88-PAD94 PAD97-PAD103 PAD106-PAD112 PAD115-PAD126 PAD128-PAD135 PAD137-PAD144 PAD146-PAD153 PAD155-PAD162 PAD164-PAD171 PAD173-PAD180 PAD182-PAD186 PAD194-PAD240 PAD249-PAD259 PAD267 PAD268 PAD276 PAD277 PAD285 PAD286 PAD294 PAD295 PAD303 PAD304 PAD312 PAD313 PAD321-PAD331 PAD339 PAD340 PAD348 PAD349 PAD357 PAD358 PAD366 PAD367 PAD375 PAD376 PAD384 PAD390 PAD395-PAD463 PAD471-PAD544 PAD547-PAD551 PAD554-PAD558 PAD560-PAD615 PAD617-PAD676 PAD679-PAD683 PAD686-PAD690 PAD693-PAD697 PAD700-PAD704 PAD707-PAD711 PAD714-PAD718 PAD721-PAD725 PAD728-PAD732 PAD734 PAD742-PAD749 PAD757-PAD781 PAD783-PAD790 PAD792-PAD794 RJ-3 RX TX = wirepad:1,6/0,8: THROUGH-HOLE PAD
DC = dc-dc-converter:R-78C*-1.0: INNOLINE DC/DC-Converter 1.0 AMP SIP3 Single Output Source: Data sheet <http://www.mikrocontroller.net/attachment/150645/157764-da-01-en-DC_DC_WANDLER_R_78C5_0_1_0.pdf>
J1 = con-jack:DCJ0202: DC POWER JACK Source: DCJ0202.pdf; OC_FARNELL: unknown; OC_NEWARK: unknown
MIC5502 = SparkFun-PowerIC:MIC5205: MIC5205 150mA vreg 3.3V - VREG-00822 5V - VREG-00823; PROD_ID: VREG-00822
PAD241-PAD244 PAD751-PAD756 = wirepad:3,17/1,3: THROUGH-HOLE PAD
X1 = microbuilder:ESP-12E
X2 = microbuilder:USB: USB Connectors USBMINIB - Surface Mount Female Mini-B USB Connector 4UConnector: 06564
X3 = con-tycoelectronics:RJ45: CORCOM Modular RJ Jacks No Shield Source: www.tycoelectronics.com .. ENG_DS_1654001_1099_RJ_L_0507.pdf; MF: TYCO ELECTRONICS; MPN: RJ45-8L-B; OC_FARNELL: 1279843; OC_NEWARK: 52K4445

## Net classes
0 default: width 0.61 mm, drill 0.508 mm, clearance 0.127 mm